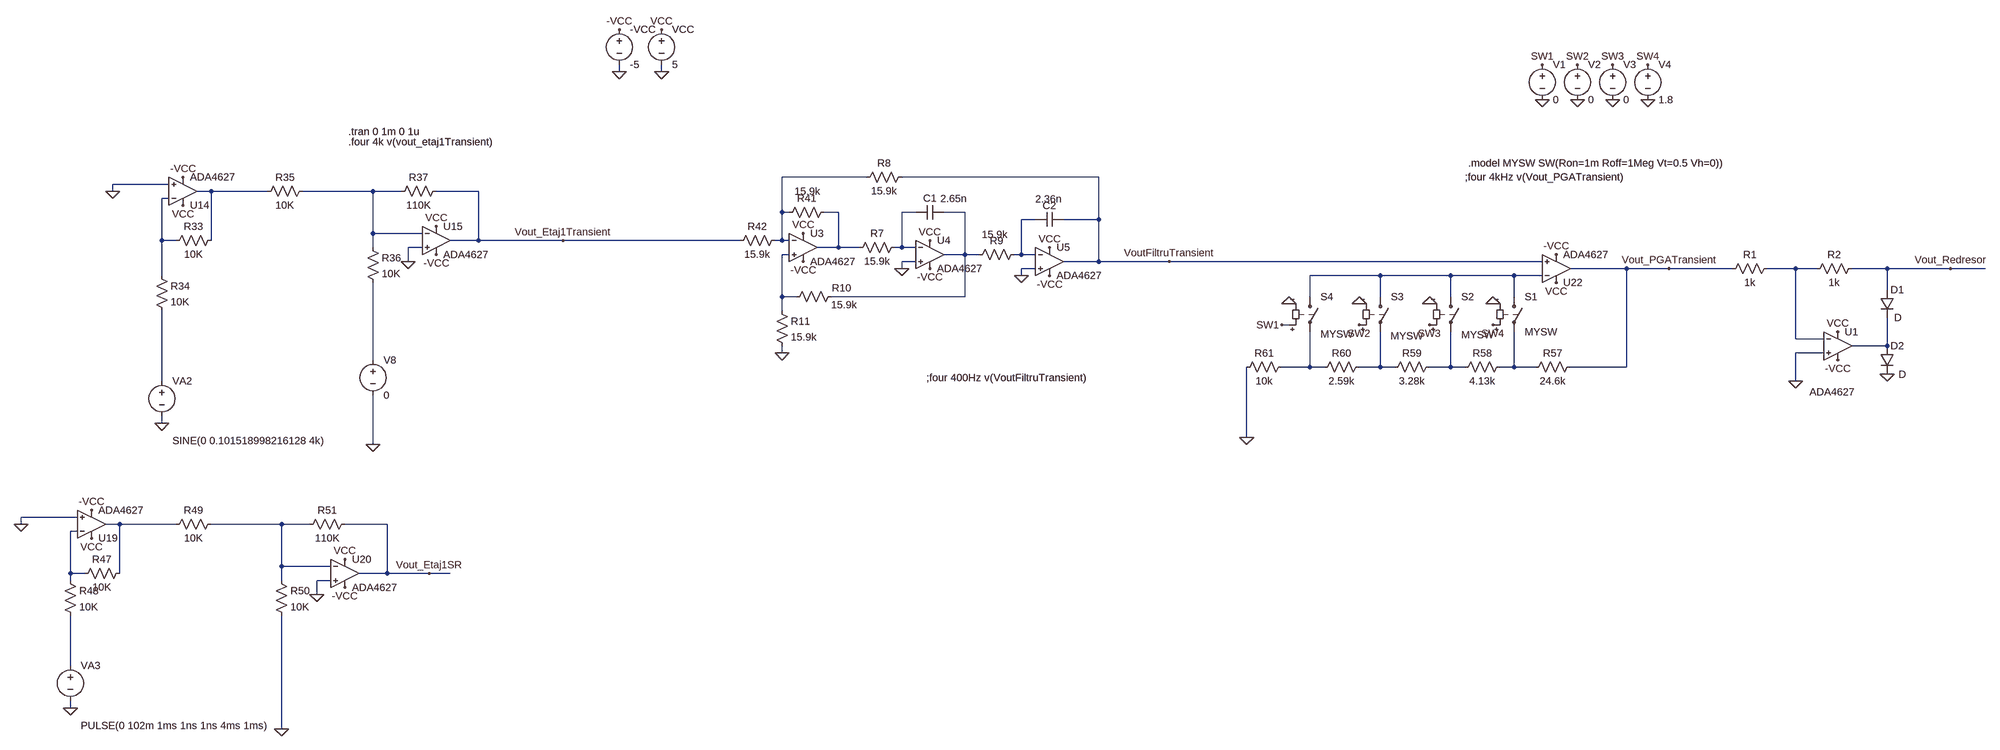
[diagram p0: schematic AnalizaTransient.asc]
AnalizaTransient.asc, the LTspice schematic file:
Version 4
SHEET 1 6708 2756
WIRE 1392 -288 1392 -304
WIRE 1488 -288 1488 -304
WIRE 1984 -48 1792 -48
WIRE 2512 -48 2064 -48
WIRE 368 -32 240 -32
WIRE 240 -16 240 -32
WIRE 464 -16 432 -16
WIRE 592 -16 464 -16
WIRE 832 -16 672 -16
WIRE 896 -16 832 -16
WIRE 1072 -16 976 -16
WIRE 368 0 352 0
WIRE 1792 32 1792 -48
WIRE 1808 32 1792 32
WIRE 1920 32 1888 32
WIRE 2096 32 2064 32
WIRE 2208 32 2160 32
WIRE 2368 48 2336 48
WIRE 2512 48 2512 -48
WIRE 2512 48 2432 48
WIRE 832 80 832 -16
WIRE 944 80 832 80
WIRE 352 96 352 0
WIRE 384 96 352 96
WIRE 464 96 464 -16
WIRE 1072 96 1072 -16
WIRE 1072 96 1008 96
WIRE 1264 96 1072 96
WIRE 1696 96 1264 96
WIRE 1792 96 1792 32
WIRE 1792 96 1776 96
WIRE 1808 96 1792 96
WIRE 832 112 832 80
WIRE 944 112 912 112
WIRE 1920 112 1920 32
WIRE 1920 112 1872 112
WIRE 1968 112 1920 112
WIRE 2064 112 2064 32
WIRE 2064 112 2048 112
WIRE 2096 112 2064 112
WIRE 1808 128 1792 128
WIRE 2208 128 2208 32
WIRE 2208 128 2160 128
WIRE 2240 128 2208 128
WIRE 2336 128 2336 48
WIRE 2336 128 2320 128
WIRE 2368 128 2336 128
WIRE 912 144 912 112
WIRE 2096 144 2064 144
WIRE 2512 144 2512 48
WIRE 2512 144 2432 144
WIRE 2672 144 2512 144
WIRE 3520 144 2672 144
WIRE 2064 160 2064 144
WIRE 2368 160 2336 160
WIRE 3712 160 3584 160
WIRE 3808 160 3712 160
WIRE 3952 160 3808 160
WIRE 4096 160 4032 160
WIRE 4144 160 4096 160
WIRE 4304 160 4224 160
WIRE 4448 160 4304 160
WIRE 4528 160 4448 160
WIRE 352 176 352 96
WIRE 2336 176 2336 160
WIRE 3152 176 2992 176
WIRE 3312 176 3152 176
WIRE 3456 176 3312 176
WIRE 3520 176 3456 176
WIRE 4304 208 4304 160
WIRE 1792 224 1792 128
WIRE 1824 224 1792 224
WIRE 2208 224 2208 128
WIRE 2208 224 1904 224
WIRE 2992 224 2992 176
WIRE 3152 224 3152 176
WIRE 3312 224 3312 176
WIRE 3456 224 3456 176
WIRE 1792 256 1792 224
WIRE 2944 288 2928 288
WIRE 4096 320 4096 160
WIRE 4160 320 4096 320
WIRE 4304 336 4304 272
WIRE 4304 336 4224 336
WIRE 1792 352 1792 336
WIRE 4160 352 4096 352
WIRE 832 368 832 192
WIRE 2992 384 2992 304
WIRE 2992 384 2928 384
WIRE 3024 384 2992 384
WIRE 3152 384 3152 304
WIRE 3152 384 3104 384
WIRE 3184 384 3152 384
WIRE 3312 384 3312 304
WIRE 3312 384 3264 384
WIRE 3344 384 3312 384
WIRE 3456 384 3456 304
WIRE 3456 384 3424 384
WIRE 3504 384 3456 384
WIRE 3712 384 3712 160
WIRE 3712 384 3584 384
WIRE 352 416 352 256
WIRE 4096 416 4096 352
WIRE 352 512 352 496
WIRE 2848 544 2848 384
WIRE 832 560 832 448
WIRE 160 864 32 864
WIRE 32 880 32 864
WIRE 256 880 224 880
WIRE 384 880 256 880
WIRE 624 880 464 880
WIRE 688 880 624 880
WIRE 864 880 768 880
WIRE 160 896 144 896
WIRE 624 976 624 880
WIRE 736 976 624 976
WIRE 144 992 144 896
WIRE 176 992 144 992
WIRE 256 992 256 880
WIRE 864 992 864 880
WIRE 864 992 800 992
WIRE 960 992 864 992
WIRE 1008 992 960 992
WIRE 144 1008 144 992
WIRE 624 1008 624 976
WIRE 736 1008 704 1008
WIRE 704 1040 704 1008
WIRE 144 1312 144 1088
WIRE 144 1408 144 1392
WIRE 624 1456 624 1088
FLAG 1392 -288 0
FLAG 1488 -288 0
FLAG 1488 -384 VCC
FLAG 1392 -384 -VCC
FLAG 2672 144 VoutFiltruTransient
FLAG 2336 176 0
FLAG 2064 160 0
FLAG 1792 352 0
FLAG 1840 144 -VCC
FLAG 2128 160 -VCC
FLAG 2400 176 -VCC
FLAG 1840 80 VCC
FLAG 2128 96 VCC
FLAG 2400 112 VCC
FLAG 240 -16 0
FLAG 400 -48 -VCC
FLAG 400 16 VCC
FLAG 912 144 0
FLAG 976 128 -VCC
FLAG 976 64 VCC
FLAG 1264 96 Vout_Etaj1Transient
FLAG 832 560 0
FLAG 352 512 0
FLAG 32 880 0
FLAG 192 848 -VCC
FLAG 192 912 VCC
FLAG 704 1040 0
FLAG 768 1024 -VCC
FLAG 768 960 VCC
FLAG 960 992 Vout_Etaj1SR
FLAG 624 1456 0
FLAG 144 1408 0
FLAG 3552 128 -VCC
FLAG 3552 192 VCC
FLAG 2848 544 0
FLAG 2928 288 SW1
FLAG 3104 288 SW2
FLAG 3264 288 SW3
FLAG 3408 288 SW4
FLAG 3808 160 Vout_PGATransient
FLAG 2944 240 0
FLAG 3104 240 0
FLAG 3264 240 0
FLAG 3408 240 0
FLAG 4096 416 0
FLAG 4192 368 -VCC
FLAG 4192 304 VCC
FLAG 4448 160 Vout_Redresor
FLAG 4304 400 0
FLAG 3520 -224 0
FLAG 3600 -224 0
FLAG 3680 -224 0
FLAG 3760 -224 0
FLAG 3760 -304 SW4
FLAG 3680 -304 SW3
FLAG 3600 -304 SW2
FLAG 3520 -304 SW1
SYMBOL voltage 1392 -400 R0
SYMATTR InstName -VCC
SYMATTR Value -5
SYMBOL voltage 1488 -400 R0
SYMATTR InstName VCC
SYMATTR Value 5
SYMBOL res 1792 80 R90
WINDOW 0 0 56 VBottom 2
WINDOW 3 32 56 VTop 2
SYMATTR InstName R42
SYMATTR Value 15.9k
SYMBOL OpAmps\\ADA4627 1840 48 R0
SYMATTR InstName U3
SYMBOL res 1904 16 R90
WINDOW 0 0 56 VBottom 2
WINDOW 3 -47 54 VTop 2
SYMATTR InstName R41
SYMATTR Value 15.9k
SYMBOL res 2064 96 R90
WINDOW 0 0 56 VBottom 2
WINDOW 3 32 56 VTop 2
SYMATTR InstName R7
SYMATTR Value 15.9k
SYMBOL OpAmps\\ADA4627 2128 64 R0
SYMATTR InstName U4
SYMBOL cap 2160 16 R90
WINDOW 0 0 32 VBottom 2
WINDOW 3 -31 -22 VTop 2
SYMATTR InstName C1
SYMATTR Value 2.65n
SYMBOL res 2080 -64 R90
WINDOW 0 0 56 VBottom 2
WINDOW 3 32 56 VTop 2
SYMATTR InstName R8
SYMATTR Value 15.9k
SYMBOL OpAmps\\ADA4627 2400 80 R0
SYMATTR InstName U5
SYMBOL res 2336 112 R90
WINDOW 0 0 56 VBottom 2
WINDOW 3 -45 60 VTop 2
SYMATTR InstName R9
SYMATTR Value 15.9k
SYMBOL cap 2432 32 R90
WINDOW 0 0 32 VBottom 2
WINDOW 3 -46 34 VTop 2
SYMATTR InstName C2
SYMATTR Value 2.36n
SYMBOL res 1920 208 R90
WINDOW 0 12 -7 VBottom 2
WINDOW 3 19 -13 VTop 2
SYMATTR InstName R10
SYMATTR Value 15.9k
SYMBOL res 1776 240 R0
SYMATTR InstName R11
SYMATTR Value 15.9k
SYMBOL OpAmps\\ADA4627 400 48 M180
SYMATTR InstName U14
SYMBOL res 480 80 R90
WINDOW 0 0 56 VBottom 2
WINDOW 3 32 56 VTop 2
SYMATTR InstName R33
SYMATTR Value 10K
SYMBOL res 336 160 R0
SYMATTR InstName R34
SYMATTR Value 10K
SYMBOL res 688 -32 R90
WINDOW 0 0 56 VBottom 2
WINDOW 3 32 56 VTop 2
SYMATTR InstName R35
SYMATTR Value 10K
SYMBOL OpAmps\\ADA4627 976 32 R0
SYMATTR InstName U15
SYMBOL res 816 96 R0
SYMATTR InstName R36
SYMATTR Value 10K
SYMBOL res 992 -32 R90
WINDOW 0 0 56 VBottom 2
WINDOW 3 32 56 VTop 2
SYMATTR InstName R37
SYMATTR Value 110K
SYMBOL voltage 352 400 R0
WINDOW 3 24 152 Left 2
WINDOW 123 24 124 Left 2
WINDOW 39 0 0 Left 0
SYMATTR Value SINE(0 0.101518998216128 4k)
SYMATTR InstName VA2
SYMBOL voltage 832 352 R0
WINDOW 123 0 0 Left 0
WINDOW 39 0 0 Left 0
SYMATTR InstName V8
SYMATTR Value 0
SYMBOL OpAmps\\ADA4627 192 944 M180
SYMATTR InstName U19
SYMBOL res 272 976 R90
WINDOW 0 0 56 VBottom 2
WINDOW 3 32 56 VTop 2
SYMATTR InstName R47
SYMATTR Value 10K
SYMBOL res 128 992 R0
SYMATTR InstName R48
SYMATTR Value 10K
SYMBOL res 480 864 R90
WINDOW 0 0 56 VBottom 2
WINDOW 3 32 56 VTop 2
SYMATTR InstName R49
SYMATTR Value 10K
SYMBOL OpAmps\\ADA4627 768 928 R0
SYMATTR InstName U20
SYMBOL res 608 992 R0
SYMATTR InstName R50
SYMATTR Value 10K
SYMBOL res 784 864 R90
WINDOW 0 0 56 VBottom 2
WINDOW 3 32 56 VTop 2
SYMATTR InstName R51
SYMATTR Value 110K
SYMBOL voltage 144 1296 R0
WINDOW 3 24 152 Left 2
WINDOW 123 24 124 Left 2
WINDOW 39 0 0 Left 0
SYMATTR Value PULSE(0 102m 1ms 1ns 1ns 4ms 1ms)
SYMATTR InstName VA3
SYMBOL res 3600 368 R90
WINDOW 0 0 56 VBottom 2
WINDOW 3 32 56 VTop 2
SYMATTR InstName R57
SYMATTR Value 24.6k
SYMBOL res 3440 368 R90
WINDOW 0 0 56 VBottom 2
WINDOW 3 32 56 VTop 2
SYMATTR InstName R58
SYMATTR Value 4.13k
SYMBOL res 3280 368 R90
WINDOW 0 0 56 VBottom 2
WINDOW 3 32 56 VTop 2
SYMATTR InstName R59
SYMATTR Value 3.28k
SYMBOL res 3120 368 R90
WINDOW 0 0 56 VBottom 2
WINDOW 3 32 56 VTop 2
SYMATTR InstName R60
SYMATTR Value 2.59k
SYMBOL res 2944 368 R90
WINDOW 0 0 56 VBottom 2
WINDOW 3 32 56 VTop 2
SYMATTR InstName R61
SYMATTR Value 10k
SYMBOL OpAmps\\ADA4627 3552 224 M180
SYMATTR InstName U22
SYMBOL sw 3456 208 R0
SYMATTR InstName S1
SYMATTR Value MYSW
SYMBOL sw 3312 208 R0
WINDOW 3 24 103 Left 2
SYMATTR Value MYSW
SYMATTR InstName S2
SYMBOL sw 3152 208 R0
WINDOW 3 23 105 Left 2
SYMATTR Value MYSW
SYMATTR InstName S3
SYMBOL sw 2992 208 R0
WINDOW 3 24 101 Left 2
SYMATTR Value MYSW
SYMATTR InstName S4
SYMBOL res 4048 144 R90
WINDOW 0 0 56 VBottom 2
WINDOW 3 32 56 VTop 2
SYMATTR InstName R1
SYMATTR Value 1k
SYMBOL res 4240 144 R90
WINDOW 0 0 56 VBottom 2
WINDOW 3 32 56 VTop 2
SYMATTR InstName R2
SYMATTR Value 1k
SYMBOL OpAmps\\ADA4627 4192 272 R0
WINDOW 3 -64 169 Left 2
SYMATTR InstName U1
SYMBOL diode 4288 208 R0
WINDOW 3 32 64 Left 2
SYMATTR InstName D1
SYMBOL diode 4288 336 R0
WINDOW 3 42 65 Left 2
SYMATTR InstName D2
SYMBOL voltage 3520 -320 R0
SYMATTR InstName V1
SYMATTR Value 0
SYMBOL voltage 3600 -320 R0
SYMATTR InstName V2
SYMATTR Value 0
SYMBOL voltage 3680 -320 R0
SYMATTR InstName V3
SYMATTR Value 0
SYMBOL voltage 3760 -320 R0
SYMATTR InstName V4
SYMATTR Value 1.8
TEXT 776 -152 Left 2 !.tran 0 1m 0 1u
TEXT 776 -128 Left 2 !.four 4k v(vout_etaj1Transient)
TEXT 2120 408 Left 2 !;four 400Hz v(VoutFiltruTransient)
TEXT 3344 -48 Left 2 !;four 4kHz v(Vout_PGATransient)
TEXT 3352 -80 Left 2 !.model MYSW SW(Ron=1m Roff=1Meg Vt=0.5 Vh=0))

The netlist it stands for:
* AnalizaTransient.asc
V§-VCC -VCC 0 -5
VCC VCC 0 5
R42 N001 Vout_Etaj1Transient 15.9k
XU3 N009 N001 VCC -VCC N005 ADA4627  ; pins In+ In- V+ V- OUT
R41 N005 N001 15.9k
R7 N006 N005 15.9k
XU4 0 N006 VCC -VCC N007 ADA4627  ; pins In+ In- V+ V- OUT
C1 N007 N006 2.65n
R8 VoutFiltruTransient N001 15.9k
XU5 0 N008 VCC -VCC VoutFiltruTransient ADA4627  ; pins In+ In- V+ V- OUT
R9 N008 N007 15.9k
C2 VoutFiltruTransient N008 2.36n
R10 N007 N009 15.9k
R11 N009 0 15.9k
XU14 0 N004 VCC -VCC N002 ADA4627  ; pins In+ In- V+ V- OUT
R33 N002 N004 10K
R34 N004 N018 10K
R35 N003 N002 10K
XU15 0 N003 VCC -VCC Vout_Etaj1Transient ADA4627  ; pins In+ In- V+ V- OUT
R36 N003 N013 10K
R37 Vout_Etaj1Transient N003 110K
VA2 N018 0 SINE(0 0.101518998216128 4k)
V8 N013 0 0
XU19 0 N021 VCC -VCC N019 ADA4627  ; pins In+ In- V+ V- OUT
R47 N019 N021 10K
R48 N021 N022 10K
R49 N020 N019 10K
XU20 0 N020 VCC -VCC Vout_Etaj1SR ADA4627  ; pins In+ In- V+ V- OUT
R50 N020 0 10K
R51 Vout_Etaj1SR N020 110K
VA3 N022 0 PULSE(0 102m 1ms 1ns 1ns 4ms 1ms)
R57 Vout_PGATransient N017 24.6k
R58 N017 N016 4.13k
R59 N016 N015 3.28k
R60 N015 N014 2.59k
R61 N014 0 10k
XU22 VoutFiltruTransient N011 VCC -VCC Vout_PGATransient ADA4627  ; pins In+ In- V+ V- OUT
S1 N011 N017 SW4 0 MYSW
S2 N011 N016 SW3 0 MYSW
S3 N011 N015 SW2 0 MYSW
S4 N011 N014 SW1 0 MYSW
R1 N010 Vout_PGATransient 1k
R2 Vout_Redresor N010 1k
XU1 0 N010 VCC -VCC N012 ADA4627  ; pins In+ In- V+ V- OUT
D1 Vout_Redresor N012 D
D2 N012 0 D
V1 SW1 0 0
V2 SW2 0 0
V3 SW3 0 0
V4 SW4 0 1.8
.model D D
.lib standard.dio
.tran 0 1m 0 1u
.four 4k v(vout_etaj1Transient)
;four 400Hz v(VoutFiltruTransient)
;four 4kHz v(Vout_PGATransient)
.model MYSW SW(Ron=1m Roff=1Meg Vt=0.5 Vh=0))
.backanno
.end